# Altium schematic sheet POWER.SchDoc: Science - Power
size Letter; DrawnBy: C.Arjune; Organization: UW Robotics; Address1: 200 University Avenue; Address2: Waterloo; Address3: Ontario; Address4: Canada N2L 3G6; SheetNumber: 1; SheetTotal: 5
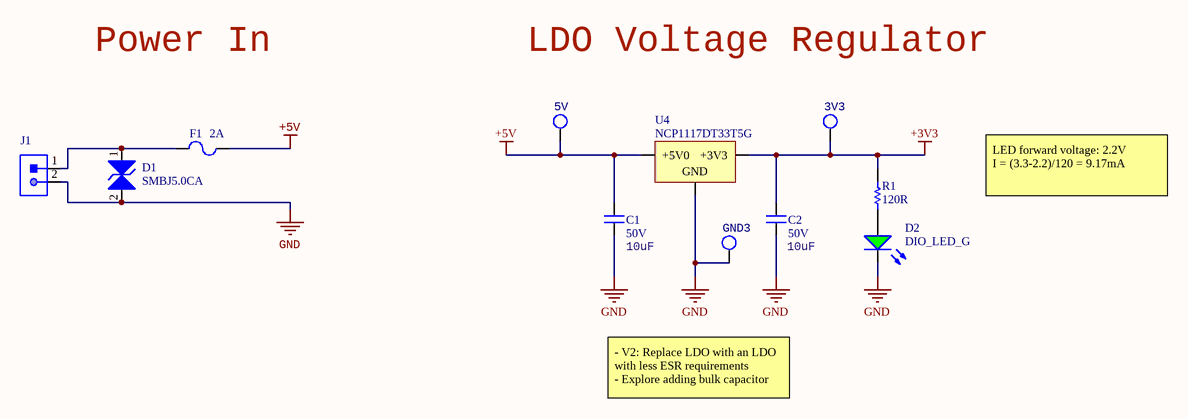
[diagram p0: POWER.SchDoc]

## Parts
3V3  TESTPOINT_LOOP  [TESTPOINT_LOOP]  (value not drawn)
5V  TESTPOINT_LOOP  [TESTPOINT_LOOP]  (value not drawn)
C1  Voltage Rating: 50V  [CAPC1206(3216)]  (hidden comment: 10uF)
C2  Voltage Rating: 50V  [CAPC1206(3216)]  (hidden comment: 10uF)
D1  Manufacturer Part Number 1: SMBJ5.0CA  [TVS_DIODE_BIDIRECTIONAL]  (hidden comment: TVS_DIODE_BIDIRECTIONAL)
D2  DIO_LED_G  [LED_0805_LINE]
F1  Current Rating: 2A  [FUSE_0603]  (hidden comment: FUSE_2A_0603)
GND3  TESTPOINT_LOOP  [TESTPOINT_LOOP]  (value not drawn)
J1  CON_2M_SM4  [JST-B2B-SM4-TB]  (value not drawn)
R1  value 120R  [RESC0603(1608)_N]  (hidden comment: RES_120R_0603)
U4  MPN: NCP1117DT33T5G  [VOLTAGE_REGULATOR]  (hidden comment: 5V0_3V3_LDO)

## Nets
+3V3: 3V3.1 C2.1 R1.2 U4.2(+3V3)
+5V: 5V.1 C1.1 F1.2 U4.3(+5V0)
GND: C1.2 C2.2 D1.2 D2.2(K) GND3.1 J1.2 U4.1(GND)
NetD1_1: D1.1 F1.1 J1.1
NetD2_1: D2.1(A) R1.1

## Notes on the sheet
- Power In
- LDO Voltage Regulator
- LED forward voltage: 2.2V
  I = (3.3-2.2)/120 = 9.17mA
- - V2: Replace LDO with an LDO with less ESR requirements
  - Explore adding bulk capacitor
- Title
- Size:
- Date:
- Letter
- Drawn By:
- Sheet
- of
- File:

## Library data of the parts
3V3 5V GND3 = TESTPOINT_LOOP: Loop testpoint through-hole pad; Manufacturer: Keystone Electronics; Manufacturer Part Number 1: 5002; Supplier Part Number 1: 36-5002-ND; Supplier 1: Digi-Key
C1 C2 = CAP_10uF_50V_1206: CAP CER 10UF 50V X5R 1206; MPN: GRT31CR61H106KE01L; Manufacturer: Murata; Dimensions: 0.126" L x 0.063" W (3.20mm x 1.6mm); Package: 1206 (3216 Metric); Value: 10uF; Supplier Part Number 1: 490-12456-1-ND; Supplier 1: Digi-Key
D1 = TVS_DIODE_BIDIRECTIONAL: TVS DIODE 5V 9.2V DO214AA; Manufacturer 1: Littelfuse; Max Surge Current: 65.3A; Reverse Breakdown Voltage: 6.4V; Peak Pulse Power: 600W; Max Breakdown Voltage: 7V; ESD Protection: Yes; Package: DO-214AA, SMB; ComponentLink1Description: Datasheet; ComponentLink1URL: https://www.littelfuse.com/~/media/electronics/datasheets/tvs_diodes/littelfuse_tvs_diode_smbj_datasheet.pdf.pdf; Supplier Part Number 1: SMBJ5.0CALFCT-ND; Supplier 1: Digi-Key; Mount: Surface Mount; Min Operating Temperature: -65°C; Max Operating Temperature: 150°C; Direction: Bidirectional; Reverse Standoff Voltage: 5V; Min Breakdown Voltage: 6.4V; Clamping Voltage: 9.2V; Breakdown Voltage: 6.4V; Polarity: Bidirectional; Power Dissipation: 600W; Peak Pulse Current: 65.3A; Composition: Zener
D2 = DIO_LED_G: LED GREEN DIFFUSED 0805 SMD; MPN: LG R971-KN-1; Manufacturer: OSRAM; Forward Voltage Drop: 2.2V; Package: 0805 (2012 Metric); Supplier Part Number 1: 475-1410-1-ND; Supplier 1: Digi-Key
F1 = FUSE_2A_0603: FUSE SMD 2A 32V; ComponentLink1URL: https://datasheet.ciiva.com/303/467-303400.pdf?src-supplier=Digi-Key; ComponentLink1Description: https://datasheet.ciiva.com/303/467-303400.pdf?src-supplier=Digi-Key; ComponentLink2URL: http://datasheet.octopart.com/0467002.NRHF-Littelfuse-datasheet-32023482.pdf?src-supplier=Future+Electronics; ComponentLink2Description: http://datasheet.octopart.com/0467002.NRHF-Littelfuse-datasheet-32023482.pdf?src-supplier=Future+Electronics; ComponentLink3URL: http://datasheet.octopart.com/0467002.NRHF-Littelfuse-datasheet-136509808.pdf?src-supplier=Future+Electronics; ComponentLink3Description: http://datasheet.octopart.com/0467002.NRHF-Littelfuse-datasheet-136509808.pdf?src-supplier=Future+Electronics; Mount: Surface Mount; Voltage Rating (AC): 32V; Voltage Rating (DC): 32V; Supplier 1: Digi-Key; Supplier Part Number 1: F7132CT-ND; Supplier Packaging 1: Cut Tape
J1 = CON_2M_SM4: CONN HEADER SMD 2POS 2MM; Manufacturer: JST; Manufacturer Part Number: B2B-PH-SM4-TB(LF)(SN); Max Current Rating: 2A; Max Voltage Rating: 100V; Supplier 1: Digi-Key; Supplier Part Number 1: 455-1734-1-ND; ComponentLink1URL: https://datasheet.ciiva.com/11748/0900766b80ddea81-11748001.pdf?src-supplier=RSComponents; ComponentLink1Description: https://datasheet.ciiva.com/11748/0900766b80ddea81-11748001.pdf?src-supplier=RSComponents; ComponentLink2URL: https://datasheet.ciiva.com/16216/b2b-ph-sm4-tblfsn-16216102.pdf?src-supplier=Future+Electronics; ComponentLink2Description: https://datasheet.ciiva.com/16216/b2b-ph-sm4-tblfsn-16216102.pdf?src-supplier=Future+Electronics; ComponentLink3URL: https://datasheet.ciiva.com/8052/80567-8052023.pdf?src-supplier=Element14; ComponentLink3Description: https://datasheet.ciiva.com/8052/80567-8052023.pdf?src-supplier=Element14; ComponentLink4URL: https://datasheet.ciiva.com/712/eph-712504.pdf?src-supplier=Digi-Key; ComponentLink4Description: https://datasheet.ciiva.com/712/eph-712504.pdf?src-supplier=Digi-Key; ComponentLink5URL: https://datasheet.ciiva.com/712/eph-712505.pdf?src-supplier=Digi-Key; ComponentLink5Description: https://datasheet.ciiva.com/712/eph-712505.pdf?src-supplier=Digi-Key; ComponentLink6URL: https://datasheet.ciiva.com/712/eph-712506.pdf?src-supplier=Digi-Key; ComponentLink6Description: https://datasheet.ciiva.com/712/eph-712506.pdf?src-supplier=Digi-Key; Pitch: 2mm
R1 = RES_120R_0603: RES SMD 120 OHM 5% 1/10W 0603; Manufacturer: Yageo; MPN: RC0603JR-07120RL; Dimensions: 0.063" L x 0.031" W (1.60mm x 0.80mm); Tolerance: 5%; Package: 0603 (1608 Metric); Supplier Part Number 1: 311-120GRCT-ND; Supplier 1: Digi-Key
U4 = 5V0_3V3_LDO: IC REG LINEAR 3.3V 1A DPAK; Manufacturer: ON Semiconductor; Current Output: 1A; Supplier Part Number 1: NCP1117DT33T5GOSCT-ND; Supplier 1: Digi-Key